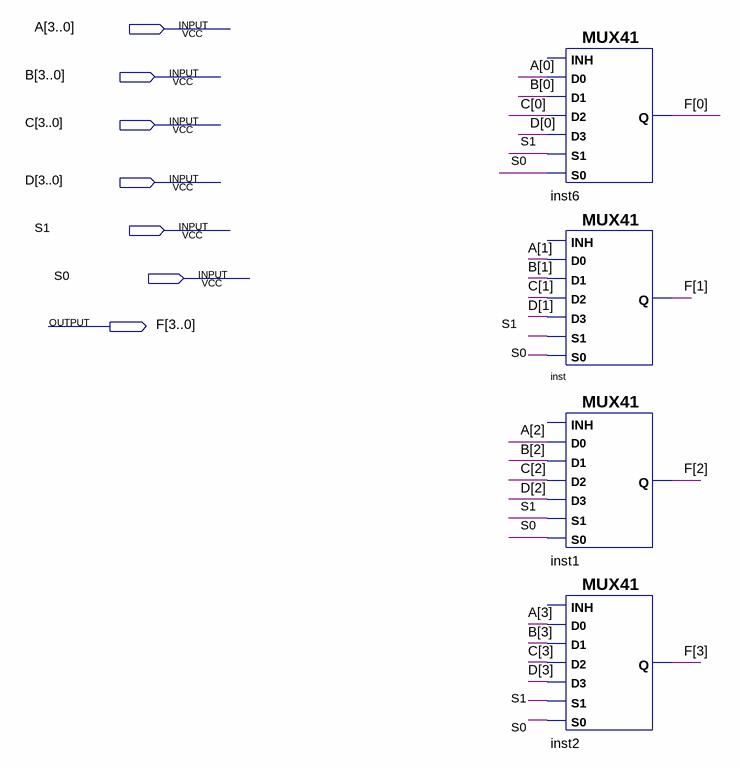
[diagram p0: schematic sheet]
// Quartus schematic BUSMAX_4x1_4Width.bdf as structural Verilog: 4 symbols, 7 pins
module BUSMAX_4x1_4Width (
  input  [3:0] A,
  input  [3:0] B,
  input  [3:0] C,
  input  [3:0] D,
  input  S1,
  input  S0,
  output [3:0] F
);

  MUX41 inst6 (.S0(S0), .D2(C[0]), .S1(S1), .D3(D[0]), .D0(A[0]), .D1(B[0]), .Q(F[0]));  // open: INH
  MUX41 inst (.S0(S0), .D2(C[1]), .S1(S1), .D3(D[1]), .D0(A[1]), .D1(B[1]), .Q(F[1]));  // open: INH
  MUX41 inst1 (.S0(S0), .D2(C[2]), .S1(S1), .D3(D[2]), .D0(A[2]), .D1(B[2]), .Q(F[2]));  // open: INH
  MUX41 inst2 (.S0(S0), .D2(C[3]), .S1(S1), .D3(D[3]), .D0(A[3]), .D1(B[3]), .Q(F[3]));  // open: INH
endmodule
